# Altium schematic sheet Relay I2C to GPIO.SchDoc
size D; SheetNumber: 3; SheetTotal: 3; SPICEModelCacheMARDRAIJ: <root> / <DocumentId>MARDRAIJ</DocumentId> / <CacheFrame Number="0"> / <Model Name="cap" Kind="MDL"> / <Text>*Default semiconductor capacitor / .MODEL CAP C()</Text> / </Model> / </CacheFrame> / </root>
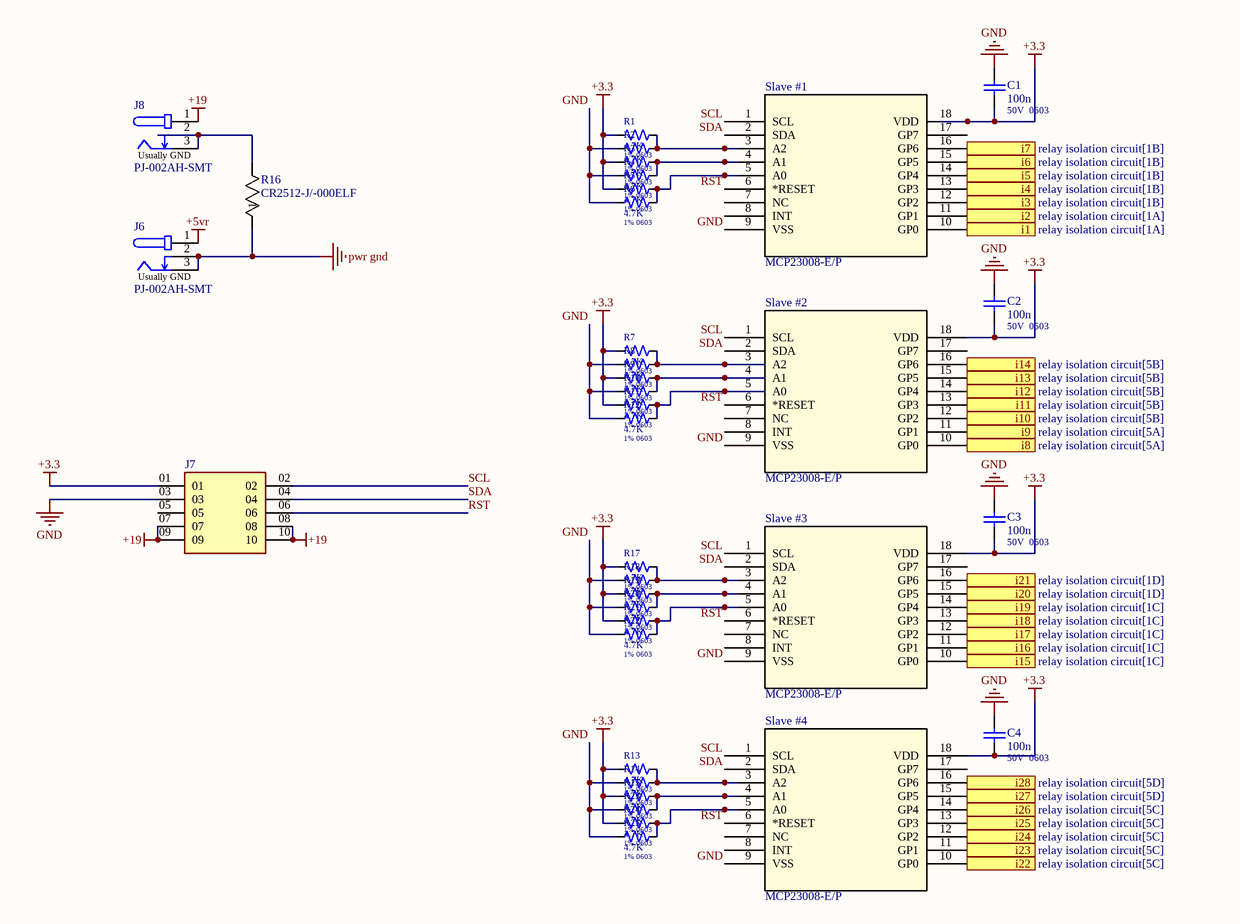
[diagram p0: Relay I2C to GPIO.SchDoc]

## Parts
C1  value 100n  TEXT: 50V  0603  [CAPC1608N_NP]  (hidden comment: GCM188R71H104KA57D)
C2  value 100n  TEXT: 50V  0603  [CAPC1608N_NP]  (hidden comment: GCM188R71H104KA57D)
C3  value 100n  TEXT: 50V  0603  [CAPC1608N_NP]  (hidden comment: GCM188R71H104KA57D)
C4  value 100n  TEXT: 50V  0603  [CAPC1608N_NP]  (hidden comment: GCM188R71H104KA57D)
J6  PJ-002AH-SMT  [PJ-002AH-SMT]
J7  (no value)  [10pinheader]
J8  PJ-002AH-SMT  [PJ-002AH-SMT]
R1  value 4.7K  text: 1% 0603  [RESC1608N]  (hidden comment: 0603_k4.7K)
R2  value 4.7K  text: 1% 0603  [RESC1608N]  (hidden comment: 0603_k4.7K)
R3  value 4.7K  text: 1% 0603  [RESC1608N]  (hidden comment: 0603_k4.7K)
R4  value 4.7K  text: 1% 0603  [RESC1608N]  (hidden comment: 0603_k4.7K)
R5  value 4.7K  text: 1% 0603  [RESC1608N]  (hidden comment: 0603_k4.7K)
R6  value 4.7K  text: 1% 0603  [RESC1608N]  (hidden comment: 0603_k4.7K)
R7  value 4.7K  text: 1% 0603  [RESC1608N]  (hidden comment: 0603_k4.7K)
R8  value 4.7K  text: 1% 0603  [RESC1608N]  (hidden comment: 0603_k4.7K)
R9  value 4.7K  text: 1% 0603  [RESC1608N]  (hidden comment: 0603_k4.7K)
R10  value 4.7K  text: 1% 0603  [RESC1608N]  (hidden comment: 0603_k4.7K)
R11  value 4.7K  text: 1% 0603  [RESC1608N]  (hidden comment: 0603_k4.7K)
R12  value 4.7K  text: 1% 0603  [RESC1608N]  (hidden comment: 0603_k4.7K)
R13  value 4.7K  text: 1% 0603  [RESC1608N]  (hidden comment: 0603_k4.7K)
R14  value 4.7K  text: 1% 0603  [RESC1608N]  (hidden comment: 0603_k4.7K)
R15  value 4.7K  text: 1% 0603  [RESC1608N]  (hidden comment: 0603_k4.7K)
R16  CR2512-J/-000ELF  [BO_CR2512]
R17  value 4.7K  text: 1% 0603  [RESC1608N]  (hidden comment: 0603_k4.7K)
R18  value 4.7K  text: 1% 0603  [RESC1608N]  (hidden comment: 0603_k4.7K)
R19  value 4.7K  text: 1% 0603  [RESC1608N]  (hidden comment: 0603_k4.7K)
R20  value 4.7K  text: 1% 0603  [RESC1608N]  (hidden comment: 0603_k4.7K)
R21  value 4.7K  text: 1% 0603  [RESC1608N]  (hidden comment: 0603_k4.7K)
R22  value 4.7K  text: 1% 0603  [RESC1608N]  (hidden comment: 0603_k4.7K)
R23  value 4.7K  text: 1% 0603  [RESC1608N]  (hidden comment: 0603_k4.7K)
R24  value 4.7K  text: 1% 0603  [RESC1608N]  (hidden comment: 0603_k4.7K)
R25  value 4.7K  text: 1% 0603  [RESC1608N]  (hidden comment: 0603_k4.7K)
Slave_#1  MCP23008-E/P  [PDIP18_300MC_MCH]
Slave_#2  MCP23008-E/P  [PDIP18_300MC_MCH]
Slave_#3  MCP23008-E/P  [PDIP18_300MC_MCH]
Slave_#4  MCP23008-E/P  [PDIP18_300MC_MCH]

## Ports
i1 (see relay isolation circuit[1A]), i2 (see relay isolation circuit[1A]), i3 (see relay isolation circuit[1B]), i4 (see relay isolation circuit[1B]), i5 (see relay isolation circuit[1B]), i6 (see relay isolation circuit[1B]), i7 (see relay isolation circuit[1B]), i8 (see relay isolation circuit[5A]), i9 (see relay isolation circuit[5A]), i10 (see relay isolation circuit[5B]), i11 (see relay isolation circuit[5B]), i12 (see relay isolation circuit[5B]), i13 (see relay isolation circuit[5B]), i14 (see relay isolation circuit[5B]), i15 (see relay isolation circuit[1C]), i16 (see relay isolation circuit[1C]), i17 (see relay isolation circuit[1C]), i18 (see relay isolation circuit[1C]), i19 (see relay isolation circuit[1C]), i20 (see relay isolation circuit[1D]), i21 (see relay isolation circuit[1D]), i22 (see relay isolation circuit[5C]), i23 (see relay isolation circuit[5C]), i24 (see relay isolation circuit[5C]), i25 (see relay isolation circuit[5C]), i26 (see relay isolation circuit[5C]), i27 (see relay isolation circuit[5D]), i28 (see relay isolation circuit[5D])

## Nets
+3.3: C1.1 C2.1 C3.1 C4.1 J7.01 R1.1 R3.1 R5.1 R7.1 R9.1 R11.1 R13.1 R15.1 R17.1 R19.1 R21.1 R24.1 Slave_#1.18(VDD) Slave_#2.18(VDD) Slave_#3.18(VDD) Slave_#4.18(VDD)
+5vr: J6.1
+19: J7.07 J7.08 J7.09 J7.10 J8.1
GND: C1.2 C2.2 C3.2 C4.2 J7.03 R2.1 R4.1 R6.1 R8.1 R10.1 R12.1 R14.1 R18.1 R20.1 R22.1 R23.1 R25.1 Slave_#1.9(VSS) Slave_#2.9(VSS) Slave_#3.9(VSS) Slave_#4.9(VSS)
pwr gnd: J6.2 J6.3 R16.1
i1: Slave_#1.10(GP0) ; port i1
i2: Slave_#1.11(GP1) ; port i2
i3: Slave_#1.12(GP2) ; port i3
i4: Slave_#1.13(GP3) ; port i4
i5: Slave_#1.14(GP4) ; port i5
i6: Slave_#1.15(GP5) ; port i6
i7: Slave_#1.16(GP6) ; port i7
i8: Slave_#2.10(GP0) ; port i8
i9: Slave_#2.11(GP1) ; port i9
i10: Slave_#2.12(GP2) ; port i10
i11: Slave_#2.13(GP3) ; port i11
i12: Slave_#2.14(GP4) ; port i12
i13: Slave_#2.15(GP5) ; port i13
i14: Slave_#2.16(GP6) ; port i14
i15: Slave_#3.10(GP0) ; port i15
i16: Slave_#3.11(GP1) ; port i16
i17: Slave_#3.12(GP2) ; port i17
i18: Slave_#3.13(GP3) ; port i18
i19: Slave_#3.14(GP4) ; port i19
i20: Slave_#3.15(GP5) ; port i20
i21: Slave_#3.16(GP6) ; port i21
i22: Slave_#4.10(GP0) ; port i22
i23: Slave_#4.11(GP1) ; port i23
i24: Slave_#4.12(GP2) ; port i24
i25: Slave_#4.13(GP3) ; port i25
i26: Slave_#4.14(GP4) ; port i26
i27: Slave_#4.15(GP5) ; port i27
i28: Slave_#4.16(GP6) ; port i28
RST: J7.06 Slave_#1.6(*RESET) Slave_#2.6(*RESET) Slave_#3.6(*RESET) Slave_#4.6(*RESET)
SCL: J7.02 Slave_#1.1(SCL) Slave_#2.1(SCL) Slave_#3.1(SCL) Slave_#4.1(SCL)
SDA: J7.04 Slave_#1.2(SDA) Slave_#2.2(SDA) Slave_#3.2(SDA) Slave_#4.2(SDA)
NetJ8_2: J8.2 J8.3 R16.2
NetR1_2: R1.2 R2.2 Slave_#1.3(A2)
NetR3_2: R3.2 R4.2 Slave_#1.4(A1)
NetR5_2: R5.2 R6.2 Slave_#1.5(A0)
NetR7_2: R7.2 R8.2 Slave_#2.3(A2)
NetR9_2: R9.2 R10.2 Slave_#2.4(A1)
NetR11_2: R11.2 R12.2 Slave_#2.5(A0)
NetR13_2: R13.2 R14.2 Slave_#4.3(A2)
NetR15_2: R15.2 R23.2 Slave_#4.4(A1)
NetR17_2: R17.2 R18.2 Slave_#3.3(A2)
NetR19_2: R19.2 R20.2 Slave_#3.4(A1)
NetR21_2: R21.2 R22.2 Slave_#3.5(A0)
NetR24_2: R24.2 R25.2 Slave_#4.5(A0)

Not connected (* = marked no-connect by the designer): J7 05; Slave_#1 7(NC) 8(INT) 17(GP7); Slave_#2 7(NC) 8(INT) 17(GP7); Slave_#3 7(NC) 8(INT) 17(GP7); Slave_#4 7(NC) 8(INT) 17(GP7)

## Notes on the sheet
- (in symbol PJ-002AH-SMT) Usually GND

## Library data of the parts
C1-C4 = CAP_n100n_0603_50V: Cap 100nF, 50V, X7R, Ceramic, 1608(0603); Manufacturer: Murata Electronics North America; Value_Sort: 100e-9; TOLERANCE: 10%; VOLTAGE: 50; LatestRevisionAuthor: David Class; Supplier 1: Digi-Key; Supplier Part Number 1: 490-4779-1-ND; Manufacturer Part Number: GCM188R71H104KA57D; HelpURL: http://search.digikey.com/scripts/DkSearch/dksus.dll?Detail&name=490-4779-1-ND; ComponentLink1URL: http://search.murata.co.jp/Ceramy/image/img/PDF/ENG/GCM188R71H104KA57.pdf; ComponentLink1Description: Datasheet; DIELECTRIC: X7R; PackageReference: 1608[0603]
J6 J8 = PJ-002AH-SMT: 2.1mm x 5.5mm Barrel Jack 5A@24V 30mOhm Contact Resistance; Manufacturer: CUI Inc; LatestRevisionComment: rev2 - decresed hole size by .1mm check footprint; LatestRevisionAuthor: David Class; LatestRevisionDate: 24-Nov-09; HelpURL: http://search.digikey.com/scripts/DkSearch/dksus.dll?Detail&name=CP-002AHPJCT-ND; Manufacturer Part Number: PJ-002AH-SMT; ComponentLink1URL: http://www.cui.com/pdffiles/PJ-002AH-SMT.pdf; ComponentLink1Description: Datasheet; ComponentLink2URL: http://www.cui.com/adtemplate.asp?invky=501659; ComponentLink2Description: Manufacturer Website; Supplier 1: Digi-Key; Supplier Part Number 1: CP-002AHPJCT-ND; Mounting Type: SM
J7 = TMMH-105-01-F-D: Package: None; Price: None; Value: *; MP: TMMH-105-01-F-D; Availability: Unavailable
R1-R15 R17-R25 = 0603_k4.7K: RES 4.7K OHM 1/10W 1% 0603 SMD; Manufacturer: Vishay Dale; Manufacturer Part Number: CRCW06034K70FKEA; Value_Sort: 4700; Power (Watts): 0.1W, 1/10W; Temperature Coefficient: ±100ppm/°C; Supplier 1: Digi-Key; RoHS: RoHS Compliant; Category: Resistors; Stock 1: 56790; Pricing 1: 10=0.081, 50=0.0436, 200=0.0251, 1000=0.01711 (USD); Packaging: Cut Tape (CT); Resistance (Ohms): 4.7k; Tolerance: ±1%; Composition: Thick Film; Features: Automotive AEC-Q200 Qualified; Package / Case: 0603 (1608 Metric); Supplier Device Package: 0603 (1608 Metric); Size / Dimension: 0.061" L x 0.033" W (1.55mm x 0.85mm); Height: 0.020" (0.50mm); Number of Terminations: 2; ComponentLink1URL: http://www.vishay.com/doc?20035; ComponentLink1Description: http://www.vishay.com/doc?20035; Supplier Part Number 1: 541-4.70KHCT-ND
R16 = CR2512-J/-000ELF: No Description Available; Mfr_Name: Bourns Electronics; Copyright: Copyright (C) 2022 Ultra Librarian. All rights reserved.; Manufacturer_Part_Number: CR2512-J/-000ELF; Digi-Key_Part_Number_1: CR2512-J/-000ELFCT-ND; Digi-Key_Part_Number_2: CR2512-J/-000ELFDKR-ND; Digi-Key_Part_Number_3: CR2512-J/-000ELFTR-ND; RefDes: RefDes; Type: DEV
Slave_#1-Slave_#4 = MCP23008-E/P: No Description Available; Mfr_Name: Microchip; Copyright: Copyright (C) 2022 Ultra Librarian. All rights reserved.; Manufacturer_Part_Number: MCP23008-E/P; Digi-Key_Part_Number_1: MCP23008-E/P-ND; RefDes: RefDes; Type: DEV